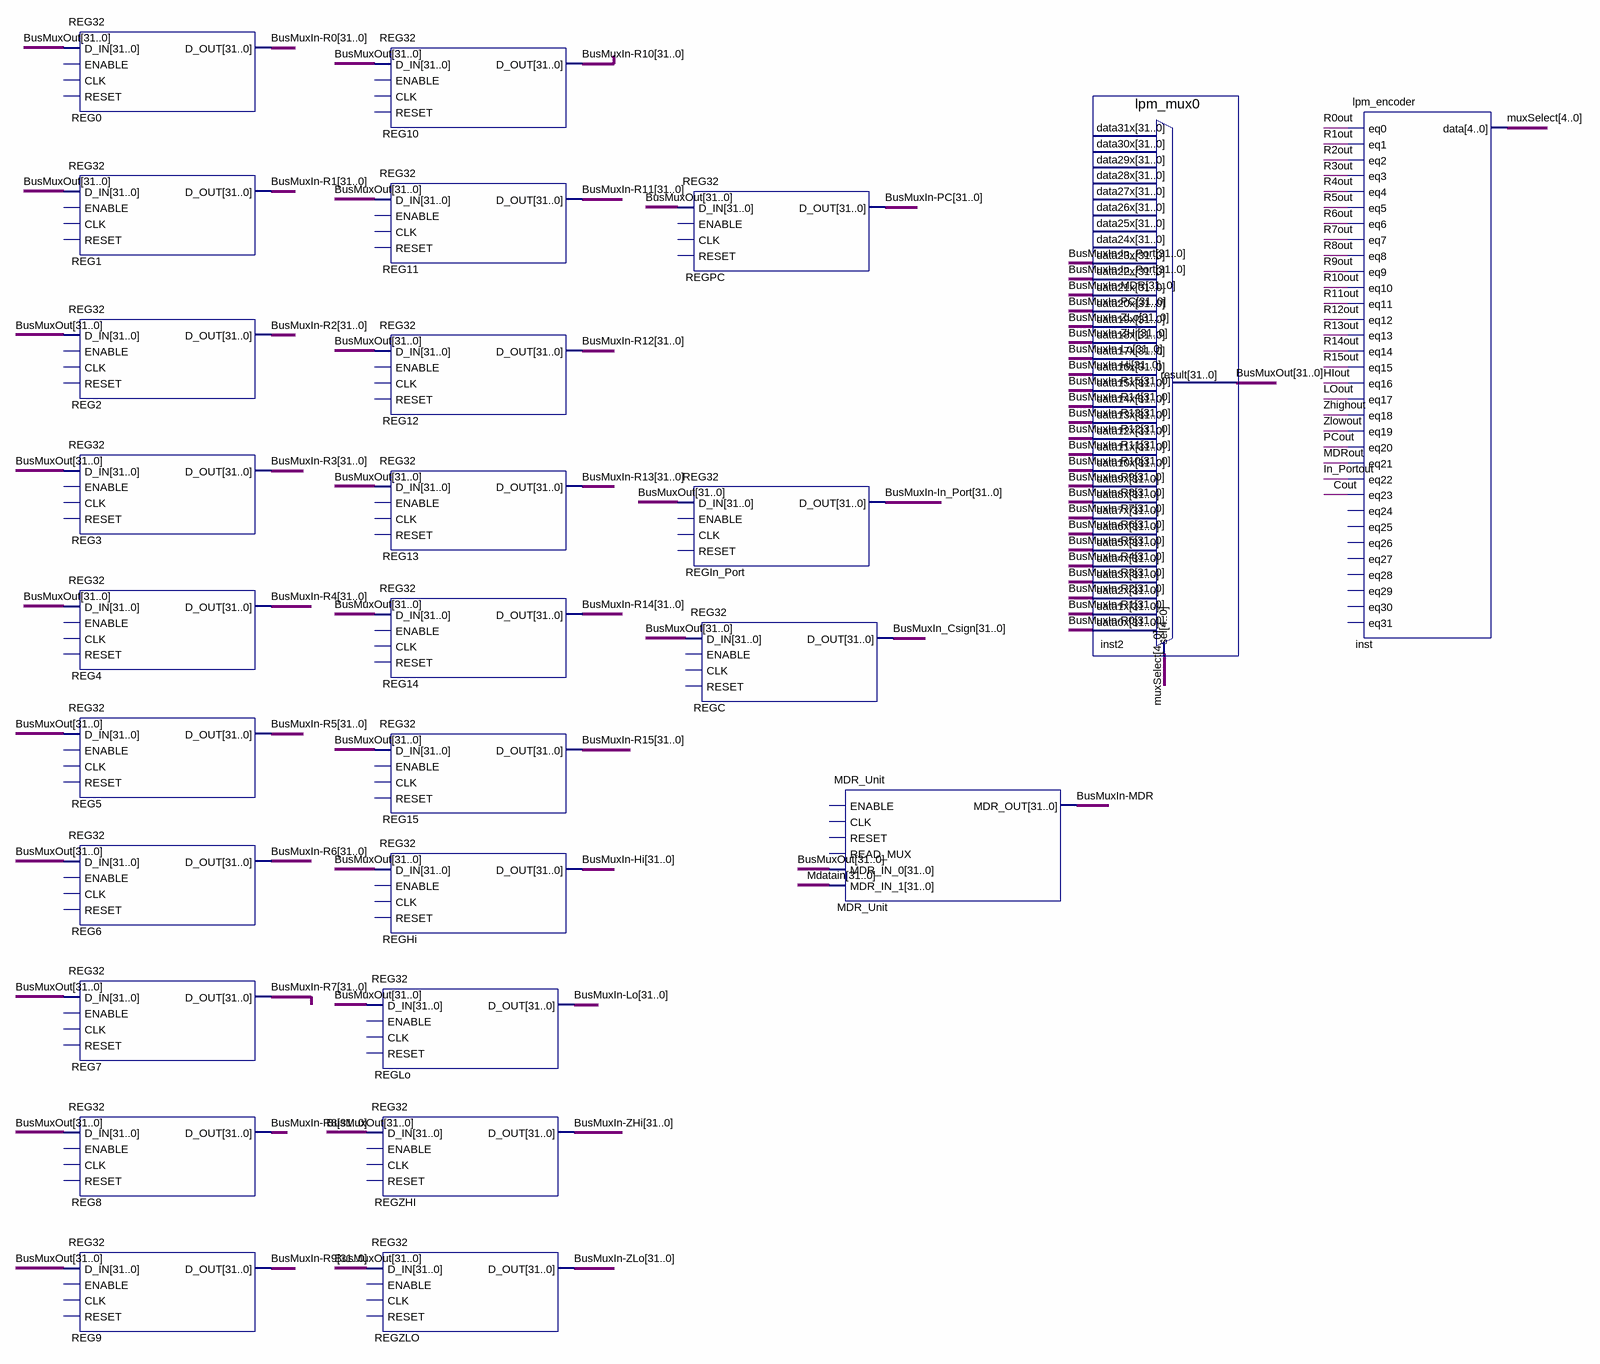
[diagram p0: schematic sheet]
// Quartus schematic Bus.bdf as structural Verilog: 26 symbols, 0 pins
module Bus (
);

  wire \BusMuxIn-MDR_1bit , Cout, HIout, In_Portout, LOout, MDRout, PCout, R0out, R1out, R2out, R3out, R4out,
       R5out, R6out, R7out, R8out, R9out, R10out, R11out, R12out, R13out, R14out, R15out, Zhighout, Zlowout;
  wire [4:0] muxSelect;
  wire [31:0] \BusMuxIn-Hi , \BusMuxIn-In_Port , \BusMuxIn-Lo , \BusMuxIn-MDR , \BusMuxIn-PC , \BusMuxIn-R0 ,
       \BusMuxIn-R1 , \BusMuxIn-R2 , \BusMuxIn-R3 , \BusMuxIn-R4 , \BusMuxIn-R5 , \BusMuxIn-R6 ,
       \BusMuxIn-R7 , \BusMuxIn-R8 , \BusMuxIn-R9 , \BusMuxIn-R10 , \BusMuxIn-R11 , \BusMuxIn-R12 ,
       \BusMuxIn-R13 , \BusMuxIn-R14 , \BusMuxIn-R15 , \BusMuxIn-ZHi , \BusMuxIn-ZLo , BusMuxIn_Csign,
       BusMuxOut, Mdatain;

  REG32 REG0 (.D_IN(BusMuxOut), .D_OUT(\BusMuxIn-R0 ));  // open: ENABLE, CLK, RESET
  REG32 REG1 (.D_IN(BusMuxOut), .D_OUT(\BusMuxIn-R1 ));  // open: ENABLE, CLK, RESET
  REG32 REG2 (.D_IN(BusMuxOut), .D_OUT(\BusMuxIn-R2 ));  // open: ENABLE, CLK, RESET
  REG32 REG3 (.D_IN(BusMuxOut), .D_OUT(\BusMuxIn-R3 ));  // open: ENABLE, CLK, RESET
  REG32 REG4 (.D_IN(BusMuxOut), .D_OUT(\BusMuxIn-R4 ));  // open: ENABLE, CLK, RESET
  REG32 REG5 (.D_IN(BusMuxOut), .D_OUT(\BusMuxIn-R5 ));  // open: ENABLE, CLK, RESET
  REG32 REG6 (.D_IN(BusMuxOut), .D_OUT(\BusMuxIn-R6 ));  // open: ENABLE, CLK, RESET
  REG32 REG7 (.D_IN(BusMuxOut), .D_OUT(\BusMuxIn-R7 ));  // open: ENABLE, CLK, RESET
  REG32 REG8 (.D_IN(BusMuxOut), .D_OUT(\BusMuxIn-R8 ));  // open: ENABLE, CLK, RESET
  REG32 REG9 (.D_IN(BusMuxOut), .D_OUT(\BusMuxIn-R9 ));  // open: ENABLE, CLK, RESET
  REG32 REG10 (.D_IN(BusMuxOut), .D_OUT(\BusMuxIn-R10 ));  // open: ENABLE, CLK, RESET
  REG32 REG11 (.D_IN(BusMuxOut), .D_OUT(\BusMuxIn-R11 ));  // open: ENABLE, CLK, RESET
  REG32 REG12 (.D_IN(BusMuxOut), .D_OUT(\BusMuxIn-R12 ));  // open: ENABLE, CLK, RESET
  REG32 REG13 (.D_IN(BusMuxOut), .D_OUT(\BusMuxIn-R13 ));  // open: ENABLE, CLK, RESET
  REG32 REG14 (.D_IN(BusMuxOut), .D_OUT(\BusMuxIn-R14 ));  // open: ENABLE, CLK, RESET
  REG32 REG15 (.D_IN(BusMuxOut), .D_OUT(\BusMuxIn-R15 ));  // open: ENABLE, CLK, RESET
  REG32 REGHi (.D_IN(BusMuxOut), .D_OUT(\BusMuxIn-Hi ));  // open: ENABLE, CLK, RESET
  REG32 REGLo (.D_IN(BusMuxOut), .D_OUT(\BusMuxIn-Lo ));  // open: ENABLE, CLK, RESET
  REG32 REGZHI (.D_IN(BusMuxOut), .D_OUT(\BusMuxIn-ZHi ));  // open: ENABLE, CLK, RESET
  REG32 REGZLO (.D_IN(BusMuxOut), .D_OUT(\BusMuxIn-ZLo ));  // open: ENABLE, CLK, RESET
  REG32 REGPC (.D_IN(BusMuxOut), .D_OUT(\BusMuxIn-PC ));  // open: ENABLE, CLK, RESET
  REG32 REGIn_Port (.D_IN(BusMuxOut), .D_OUT(\BusMuxIn-In_Port ));  // open: ENABLE, CLK, RESET
  REG32 REGC (.D_IN(BusMuxOut), .D_OUT(BusMuxIn_Csign));  // open: ENABLE, CLK, RESET
  MDR_Unit MDR_Unit (
    .MDR_IN_0(BusMuxOut), .MDR_IN_1(Mdatain), .MDR_OUT(\BusMuxIn-MDR_1bit ));  // open: ENABLE, CLK, RESET, READ_MUX
  lpm_mux0 inst2 (
    .data23x(\BusMuxIn-In_Port ), .data22x(\BusMuxIn-In_Port ), .data21x(\BusMuxIn-MDR ),
    .data20x(\BusMuxIn-PC ), .data19x(\BusMuxIn-ZLo ), .data18x(\BusMuxIn-ZHi ), .data17x(\BusMuxIn-Lo ),
    .data16x(\BusMuxIn-Hi ), .data15x(\BusMuxIn-R15 ), .data14x(\BusMuxIn-R14 ), .data13x(\BusMuxIn-R13 ),
    .data12x(\BusMuxIn-R12 ), .data11x(\BusMuxIn-R11 ), .data10x(\BusMuxIn-R10 ), .data9x(\BusMuxIn-R9 ),
    .data8x(\BusMuxIn-R8 ), .data7x(\BusMuxIn-R7 ), .data6x(\BusMuxIn-R6 ), .data5x(\BusMuxIn-R5 ),
    .data4x(\BusMuxIn-R4 ), .data3x(\BusMuxIn-R3 ), .data2x(\BusMuxIn-R2 ), .data1x(\BusMuxIn-R1 ),
    .data0x(\BusMuxIn-R0 ), .sel(muxSelect), .result(BusMuxOut));  // open: data31x, data30x, data29x, data28x, data27x, data26x, data25x, data24x
  lpm_encoder inst (
    .eq0(R0out), .eq1(R1out), .eq2(R2out), .eq3(R3out), .eq4(R4out), .eq5(R5out), .eq6(R6out), .eq7(R7out),
    .eq8(R8out), .eq9(R9out), .eq10(R10out), .eq11(R11out), .eq12(R12out), .eq13(R13out), .eq14(R14out),
    .eq15(R15out), .eq16(HIout), .eq17(LOout), .eq18(Zhighout), .eq19(Zlowout), .eq20(PCout), .eq21(MDRout),
    .eq22(In_Portout), .eq23(Cout), .data(muxSelect));  // open: eq24, eq25, eq26, eq27, eq28, eq29, eq30, eq31
endmodule
